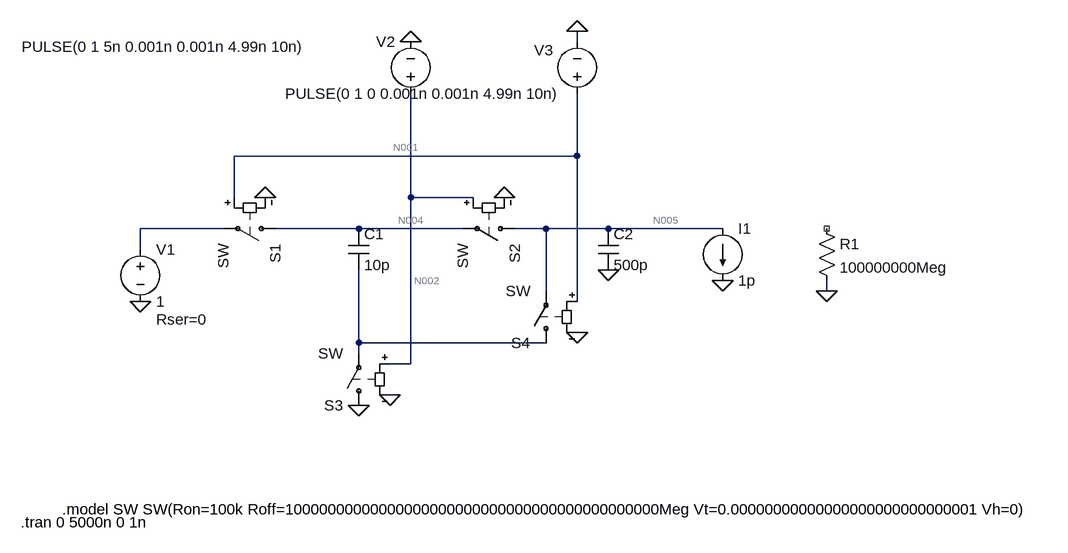
[diagram p0: schematic Draft4.asc]
Draft4.asc, the LTspice schematic file:
Version 4
SHEET 1 1780 680
WIRE 736 -208 736 -224
WIRE 736 -32 736 -128
WIRE 736 -32 208 -32
WIRE 208 32 208 -32
WIRE 480 32 480 -128
WIRE 576 32 480 32
WIRE 192 80 64 80
WIRE 400 80 272 80
WIRE 560 80 400 80
WIRE 688 80 640 80
WIRE 784 80 688 80
WIRE 960 80 784 80
WIRE 64 112 64 80
WIRE 688 176 688 80
WIRE 1120 176 1120 160
WIRE 736 192 736 -32
WIRE 400 256 400 144
WIRE 688 256 400 256
WIRE 400 272 400 256
WIRE 480 288 480 32
WIRE 480 288 448 288
FLAG 480 -208 0
FLAG 736 -224 0
FLAG 64 192 0
FLAG 1120 176 0
FLAG 784 144 0
FLAG 400 352 0
FLAG 448 336 0
FLAG 256 32 0
FLAG 624 32 0
FLAG 736 240 0
FLAG 960 160 0
SYMBOL voltage 64 96 R0
WINDOW 123 0 0 Left 2
WINDOW 39 24 124 Left 2
SYMATTR InstName V1
SYMATTR Value 1
SYMATTR SpiceLine Rser=0
SYMBOL sw 288 80 R90
SYMATTR InstName S1
SYMBOL sw 656 80 R90
SYMATTR InstName S2
SYMBOL sw 400 368 R180
SYMATTR InstName S3
SYMBOL cap 384 80 R0
SYMATTR InstName C1
SYMATTR Value 10p
SYMBOL cap 768 80 R0
SYMATTR InstName C2
SYMATTR Value 500p
SYMBOL voltage 480 -112 R180
WINDOW 0 24 96 Left 2
WINDOW 3 160 88 Left 2
WINDOW 123 0 0 Left 2
WINDOW 39 0 0 Left 2
SYMATTR InstName V2
SYMATTR Value PULSE(0 1 5n 0.001n 0.001n 4.99n 10n)
SYMBOL voltage 736 -112 R180
WINDOW 0 37 83 Left 2
WINDOW 3 24 16 Left 2
WINDOW 123 0 0 Left 2
WINDOW 39 0 0 Left 2
SYMATTR InstName V3
SYMATTR Value PULSE(0 1 0 0.001n 0.001n 4.99n 10n)
SYMBOL sw 688 272 R180
SYMATTR InstName S4
SYMBOL res 1104 64 R0
SYMATTR InstName R1
SYMATTR Value 100000000Meg
SYMBOL current 960 80 R0
WINDOW 123 0 0 Left 2
WINDOW 39 0 0 Left 2
SYMATTR InstName I1
SYMATTR Value 1p
TEXT -56 512 Left 2 !.model SW SW(Ron=100k Roff=10000000000000000000000000000000000000000000Meg Vt=0.00000000000000000000000000001 Vh=0)
TEXT -120 532 Left 2 !.tran 0 5000n 0 1n

The netlist it stands for:
* Draft4.asc
V1 N003 0 1 Rser=0
S1 N004 N003 N001 0 SW
S2 N005 N004 N002 0 SW
S3 0 N006 N002 0 SW
C1 N004 N006 10p
C2 N005 0 500p
V2 N002 0 PULSE(0 1 5n 0.001n 0.001n 4.99n 10n)
V3 N001 0 PULSE(0 1 0 0.001n 0.001n 4.99n 10n)
S4 N006 N005 N001 0 SW
R1 NC_01 0 100000000Meg
I1 N005 0 1p
.model SW SW(Ron=100k Roff=10000000000000000000000000000000000000000000Meg Vt=0.00000000000000000000000000001 Vh=0)
.tran 0 5000n 0 1n
.backanno
.end

* Results of the author's LTspice run, read from the files saved beside the schematic
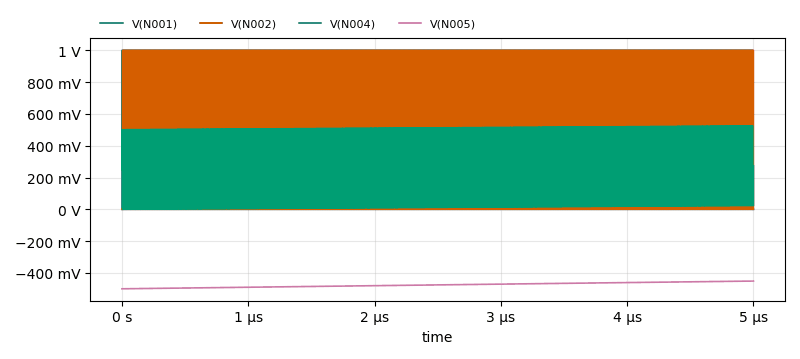
[diagram p1: Transient Analysis of Draft4.asc, plotted from the saved traces]
* Transient Analysis, 1 run:
*   V(N001): min 0 V, max 1 V, average 499.1 mV, rms 706.5 mV, last 0 V
*   V(N002): min 0 V, max 1 V, average 499.1 mV, rms 706.5 mV, last 0 V
*   V(N004): min 47.06 µV, max 525 mV, average 262.5 mV, rms 362.4 mV, last 274 mV
*   V(N005): min -500 mV, max -451.3 mV, average -475.4 mV, rms 475.7 mV, last -451.3 mV